# EAGLE design pool-controller-extender (EAGLE 6.5.0)
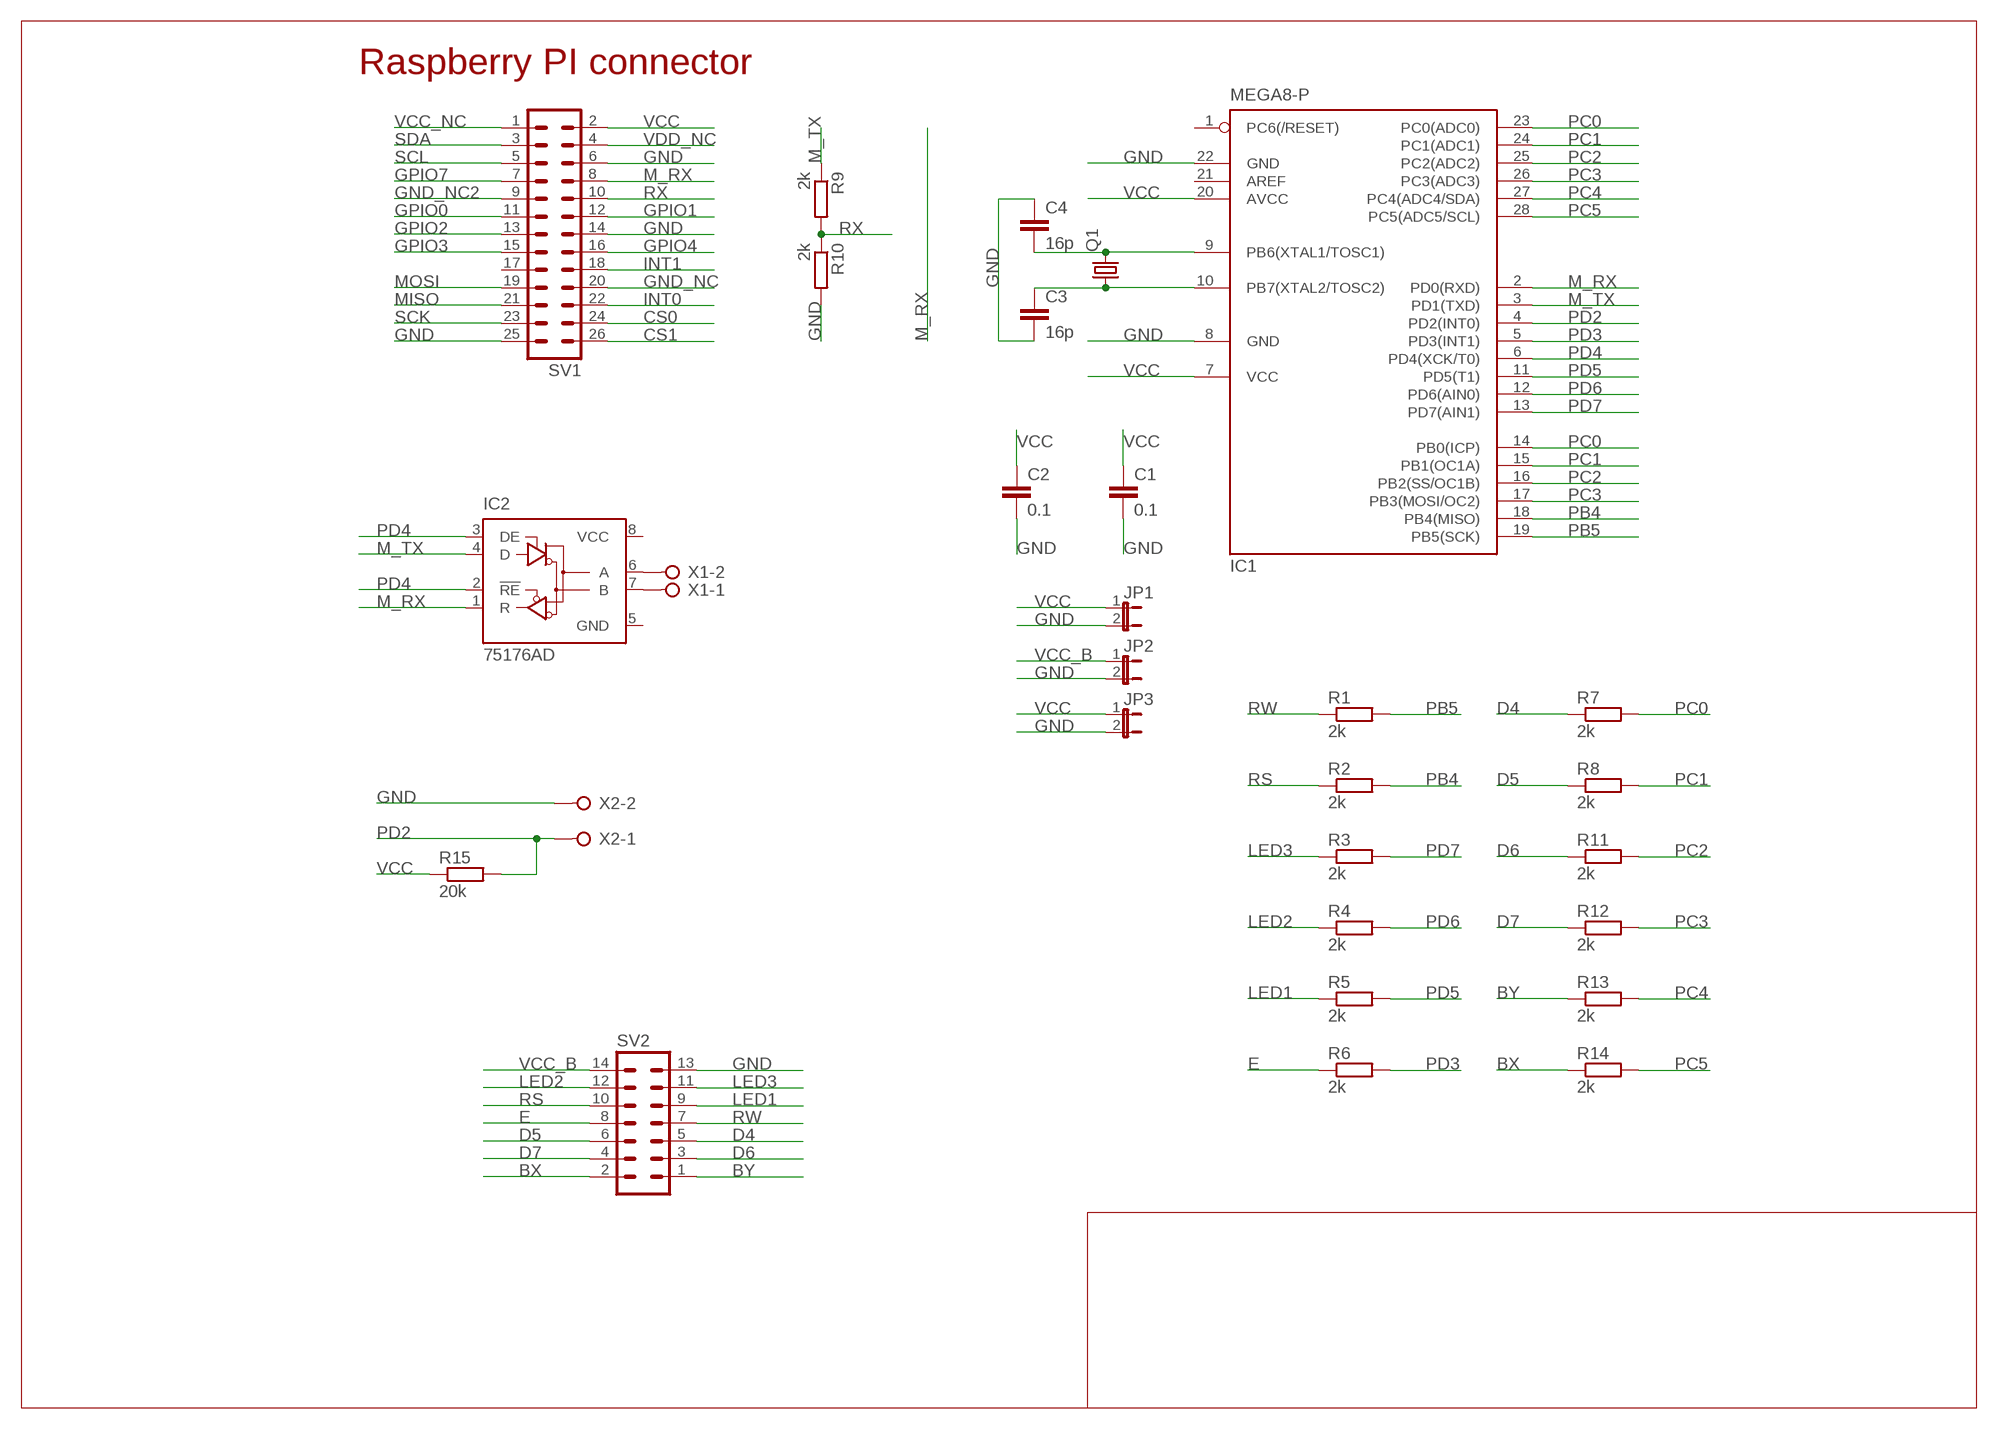
[diagram p0: schematic, sheet 1]

## Parts
C1  0.1  C-EUC0805  [C0805]
C2  0.1  C-EUC0805  [C0805]
C3  16p  C-EUC0805  [C0805]
C4  16p  C-EUC0805  [C0805]
IC1  MEGA8-P  [DIL28-3]
IC2  75176AD  [D_R-PDSO-G8]
JP1  JP1E  [JP1]
JP2  JP1E  [JP1]
JP3  JP1E  [JP1]
Q1  CRYSTALHC49S  [HC49/S]
R1  2k  R-EU_R0805  [R0805]
R2  2k  R-EU_R0805  [R0805]
R3  2k  R-EU_R0805  [R0805]
R4  2k  R-EU_R0805  [R0805]
R5  2k  R-EU_R0805  [R0805]
R6  2k  R-EU_R0805  [R0805]
R7  2k  R-EU_R0805  [R0805]
R8  2k  R-EU_R0805  [R0805]
R9  2k  R-EU_R0805  [R0805]
R10  2k  R-EU_R0805  [R0805]
R11  2k  R-EU_R0805  [R0805]
R12  2k  R-EU_R0805  [R0805]
R13  2k  R-EU_R0805  [R0805]
R14  2k  R-EU_R0805  [R0805]
R15  20k  R-EU_R0805  [R0805]
SV1  MA13-2  [MA13-2]
SV2  MA07-2W  [MA07-2W]
X1  W237-02P  [W237-132]
X2  W237-02P  [W237-132]

## Nets
BX: R14.1 SV2.2
BY: R13.1 SV2.1
CS0: SV1.24
CS1: SV1.26
D4: R7.1 SV2.5
D5: R8.1 SV2.6
D6: R11.1 SV2.3
D7: R12.1 SV2.4
E: R6.1 SV2.8
GND: C1.2 C2.2 C3.2 C4.1 IC1.8(GND) IC1.22(GND) JP1.2 JP2.2 JP3.2 R10.2 SV1.6 SV1.14 SV1.25 SV2.13 X2.2
GND_NC: SV1.20
GND_NC2: SV1.9
GPIO0: SV1.11
GPIO1: SV1.12
GPIO2: SV1.13
GPIO3: SV1.15
GPIO4: SV1.16
GPIO7: SV1.7
INT0: SV1.22
INT1: SV1.18
LED1: R5.1 SV2.9
LED2: R4.1 SV2.12
LED3: R3.1 SV2.11
M_RX: IC1.2(PD0(RXD)) IC2.1(R) SV1.8
M_TX: IC1.3(PD1(TXD)) IC2.4(D) R9.1
MISO: SV1.21
MOSI: SV1.19
N$1: IC2.6(A) X1.2
N$2: IC2.7(B) X1.1
N$4: C3.1 IC1.10(PB7(XTAL2/TOSC2)) Q1.1
N$5: C4.2 IC1.9(PB6(XTAL1/TOSC1)) Q1.2
PB4: IC1.18(PB4(MISO)) R2.2
PB5: IC1.19(PB5(SCK)) R1.2
PC0: IC1.14(PB0(ICP)) IC1.23(PC0(ADC0)) R7.2
PC1: IC1.15(PB1(OC1A)) IC1.24(PC1(ADC1)) R8.2
PC2: IC1.16(PB2(SS/OC1B)) IC1.25(PC2(ADC2)) R11.2
PC3: IC1.17(PB3(MOSI/OC2)) IC1.26(PC3(ADC3)) R12.2
PC4: IC1.27(PC4(ADC4/SDA)) R13.2
PC5: IC1.28(PC5(ADC5/SCL)) R14.2
PD2: IC1.4(PD2(INT0)) R15.2 X2.1
PD3: IC1.5(PD3(INT1)) R6.2
PD4: IC1.6(PD4(XCK/T0)) IC2.2(!RE) IC2.3(DE)
PD5: IC1.11(PD5(T1)) R5.2
PD6: IC1.12(PD6(AIN0)) R4.2
PD7: IC1.13(PD7(AIN1)) R3.2
RS: R2.1 SV2.10
RW: R1.1 SV2.7
RX: R9.2 R10.1 SV1.10
SCK: SV1.23
SCL: SV1.5
SDA: SV1.3
VCC: C1.1 C2.1 IC1.7(VCC) IC1.20(AVCC) JP1.1 JP3.1 R15.1 SV1.2
VCC_B: JP2.1 SV2.14
VCC_NC: SV1.1
VDD_NC: SV1.4
Unconnected: IC1.1(PC6(/RESET)) IC1.21(AREF) SV1.17

## Notes on the sheet
- Raspberry PI connector

## Power pins joined to a net without a drawn wire
GND: IC2.5(GND)
VCC: IC2.8(VCC)

## Library data of the parts
C1-C4 = rcl:C-EU: CAPACITOR, European symbol
IC1 = atmel:MEGA8-P: MICROCONTROLLER 8 Kbytes FLASH, 1 kbytes SRAM, 512 bytes EEPROM, USART, 4-channel 10 bit ADC, 2-channel 8 bit ADC Pin compatible with Atmega48, ATMega88, ATMega168 Source: avr.lbr; OC_FARNELL: unknown; OC_NEWARK: unknown
IC2 = 751xx:75176A: DIFFERENTIAL BUS TRANSCEIVER Source: http://focus.ti.com/lit/ds/symlink/sn75176a.pdf
JP1-JP3 = jumper:JP1E: JUMPER
Q1 = crystal:CRYSTAL: CRYSTAL; OC_FARNELL: 1667008; OC_NEWARK: unknown
R1-R15 = rcl:R-EU_: RESISTOR, European symbol
SV1 = con-lstb:MA13-2: PIN HEADER; OC_FARNELL: unknown; OC_NEWARK: unknown
SV2 = con-lstb:MA07-2W: PIN HEADER; OC_FARNELL: unknown; OC_NEWARK: unknown
X1 X2 = con-wago-508:W237-02P: WAGO SREW CLAMP; OC_FARNELL: unknown; OC_NEWARK: unknown

## Board
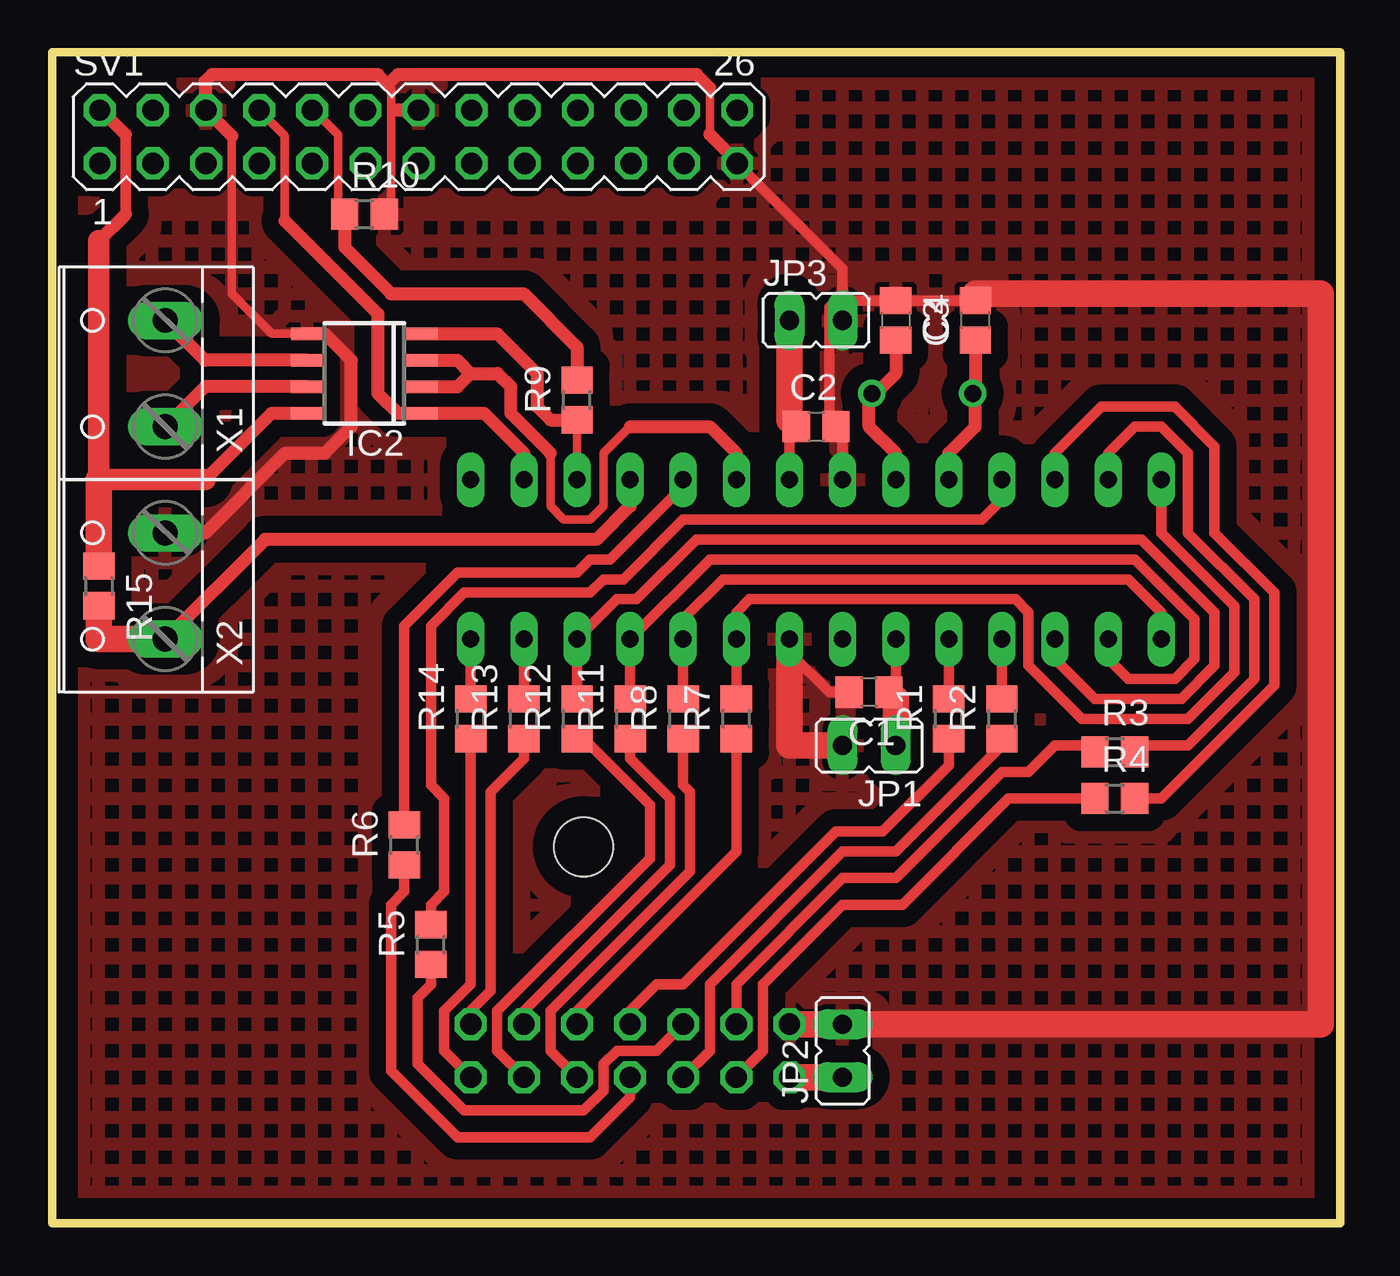
[diagram p1: board, top side]
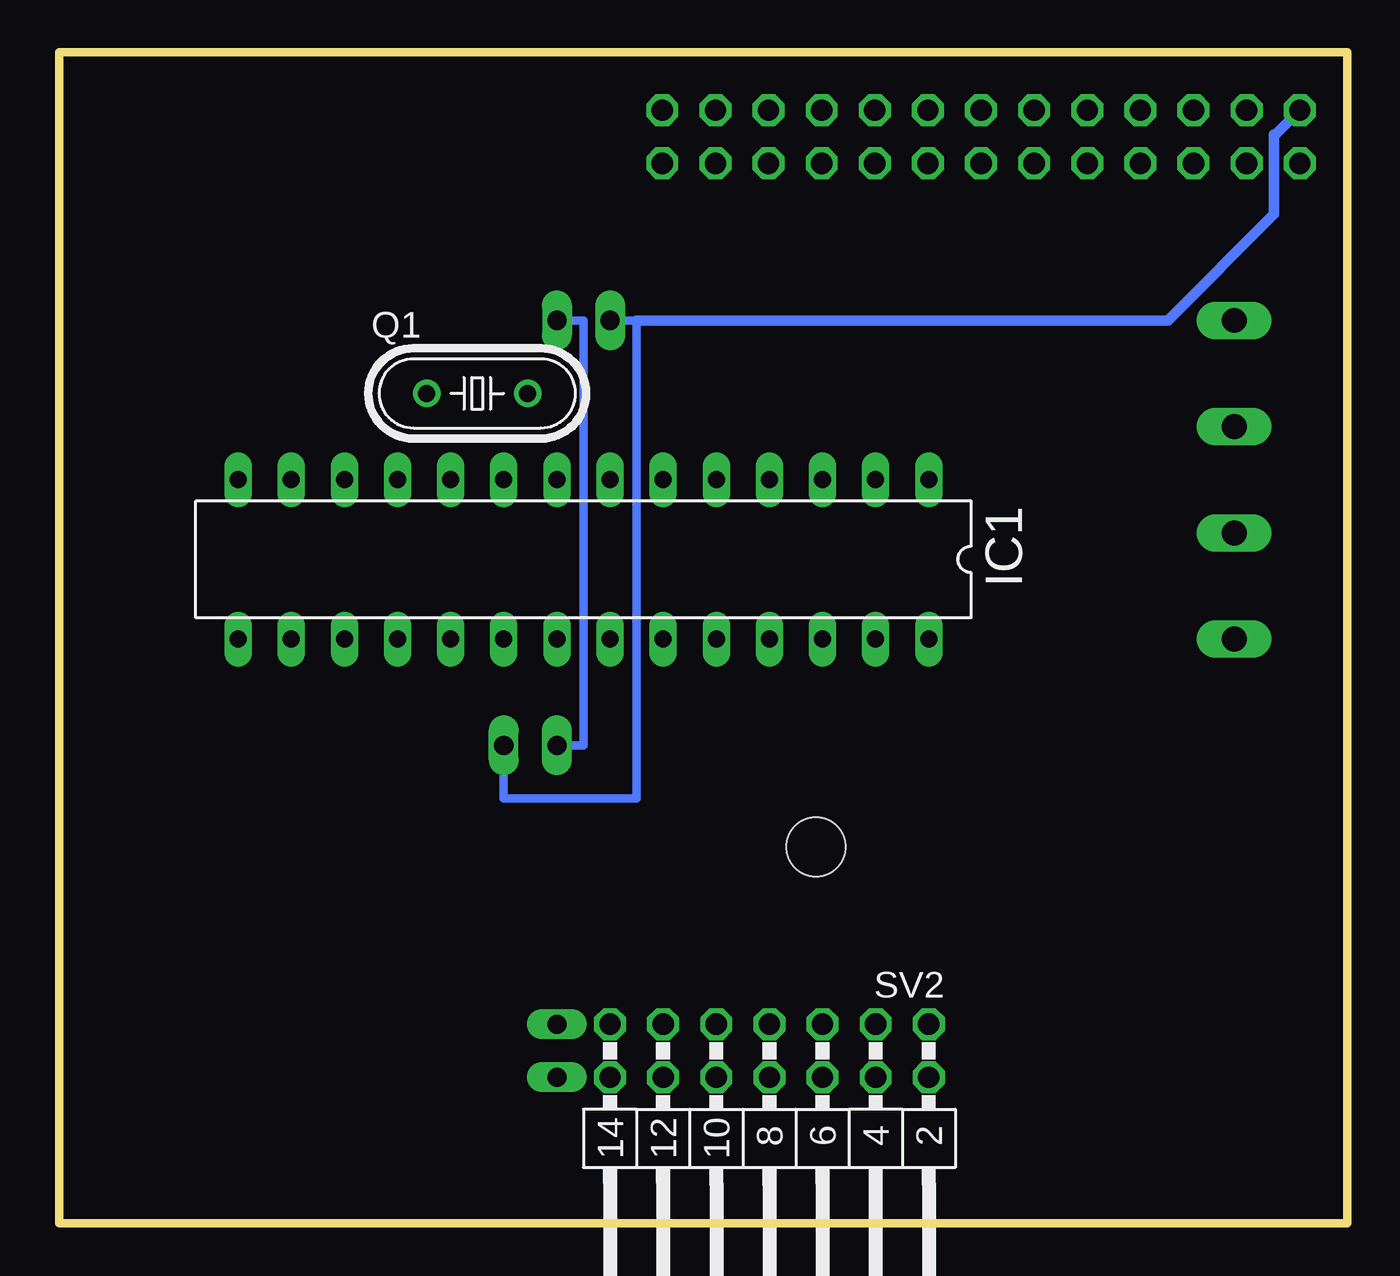
[diagram p2: board, bottom side, seen from below]

Size 61.59 x 56 mm. Coordinates in mm from the lower left corner, seen from the top.
Outline: 0,0 61.59,0 61.59,56 0,56 0,0
Copper layers (1*16): Top 0.035mm / dielectric 1.5mm / Bottom 0.035mm
Design rules "default": minimum track width 10mil, minimum drill 24mil, track to track 8mil, track to pad 8mil, pad to pad 8mil, via to via 8mil, smd to smd 8mil, copper to edge 40mil, drill to drill 8mil, minimum pad ring 10mil, minimum via ring 8mil, stop-mask expansion 4mil, vias tented up to drill 0mil, thermal gap 10mil
Holes 2.8 mm at 25.4,18

### Footprints (pad centres in the part's own frame; a part is rotated, then mirrored left to right if it is on the bottom)
C0805 = smd 1.3 x 1.5: 1 -0.95,0; 2 0.95,0
DIL28-3 = drill 0.813 long: 1 -16.51,-3.81; 2 -13.97,-3.81; 3 -11.43,-3.81; 4 -8.89,-3.81; 5 -6.35,-3.81; 6 -3.81,-3.81; 7 -1.27,-3.81; 8 1.27,-3.81; 9 3.81,-3.81; 10 6.35,-3.81; 11 8.89,-3.81; 12 11.43,-3.81; 13 13.97,-3.81; 14 16.51,-3.81; 15 16.51,3.81; 16 13.97,3.81; 17 11.43,3.81; 18 8.89,3.81; 19 6.35,3.81; 20 3.81,3.81; 21 1.27,3.81; 22 -1.27,3.81; 23 -3.81,3.81; 24 -6.35,3.81; 25 -8.89,3.81; 26 -11.43,3.81; 27 -13.97,3.81; 28 -16.51,3.81
D_R-PDSO-G8 = smd 0.6 x 1.5: 1 -1.905,-2.75; 2 -0.635,-2.75; 3 0.635,-2.75; 4 1.905,-2.75; 5 1.905,2.75; 6 0.635,2.75; 7 -0.635,2.75; 8 -1.905,2.75
JP1 = drill 0.914 long: 1 0,-1.27; 2 0,1.27
HC49/S = drill 0.813: 1 -2.413,0; 2 2.413,0
R0805 = smd 1.3 x 1.5: 1 -0.95,0; 2 0.95,0
MA13-2 = drill 1.016 octagon: 1 -15.24,-1.27; 2 -15.24,1.27; 3 -12.7,-1.27; 4 -12.7,1.27; 5 -10.16,-1.27; 6 -10.16,1.27; 7 -7.62,-1.27; 8 -7.62,1.27; 9 -5.08,-1.27; 10 -5.08,1.27; 11 -2.54,-1.27; 12 -2.54,1.27; 13 0,-1.27; 14 0,1.27; 15 2.54,-1.27; 16 2.54,1.27; 17 5.08,-1.27; 18 5.08,1.27; 19 7.62,-1.27; 20 7.62,1.27; 21 10.16,-1.27; 22 10.16,1.27; 23 12.7,-1.27; 24 12.7,1.27; 25 15.24,-1.27; 26 15.24,1.27
MA07-2W = drill 1.016 octagon: 1 -7.62,-1.27; 2 -7.62,1.27; 3 -5.08,-1.27; 4 -5.08,1.27; 5 -2.54,-1.27; 6 -2.54,1.27; 7 0,-1.27; 8 0,1.27; 9 2.54,-1.27; 10 2.54,1.27; 11 5.08,-1.27; 12 5.08,1.27; 13 7.62,-1.27; 14 7.62,1.27
W237-132 = drill 1.194 long: 1 -2.54,-0.635; 2 2.54,-0.635

### Placement (x,y rotation side)
C1  39.06,25.4 180 top
C2  36.52,38.1 0 top
C3  44.14,43.18 90 top
C4  40.33,43.18 270 top
IC1  36.52,31.75 180 bottom
IC2  14.93,40.64 90 top
JP1  39.06,22.86 90 top
JP2  37.79,8.26 0 top
JP3  36.52,43.18 270 top
Q1  41.6,39.69 0 bottom
R1  42.87,24.13 90 top
R2  45.41,24.13 90 top
R3  50.81,22.54 0 top
R4  50.81,20.32 0 top
R5  18.11,13.34 90 top
R6  16.84,18.1 90 top
R7  32.71,24.13 90 top
R8  30.17,24.13 90 top
R9  25.09,39.37 90 top
R10  14.93,48.26 0 top
R11  27.63,24.13 90 top
R12  25.09,24.13 90 top
R13  22.55,24.13 90 top
R14  20.01,24.13 90 top
R15  2.23,30.48 270 top
SV1  17.51,51.96 0 top
SV2  27.63,8.26 180 bottom
X1  4.77,40.64 90 top
X2  4.77,30.48 90 top

### Tracks (layer width: path | path; a pad name or v marks a point on that pad's centre or on a via)
BX
  Top 0.508: SV2.2 18.74,8.26 18.74,10.16 20.01,11.43 R14.1
BY
  Top 0.508: SV2.1 20.01,10.16 20.96,11.11 20.96,20.64 22.55,22.23 R13.1
D4
  Top 0.508: SV2.5 25.09,10.16 32.71,17.78 R7.1
D5
  Top 0.508: SV2.6 23.82,8.26 23.82,10.16 30.49,16.83 30.49,20.64 30.17,20.95 R8.1
D6
  Top 0.508: R11.1 27.63,22.23 29.54,20.32 29.54,17.14 22.55,10.16 SV2.3
D7
  Top 0.508: SV2.4 21.28,8.26 21.28,10.16 28.58,17.46 28.58,20 25.41,23.18 R12.1
E
  Top 0.508: SV2.8 27.63,6.03 25.73,4.13 19.38,4.13 16.2,7.3 16.2,15.24 16.84,15.88 R6.1
GND
  Top 0.406: 16.2,53.34 16.2,48.58 R10.2 | 16.2,53.34 16.2,54.29 16.04,54.45 | 7.31,53.27 SV1.6 | 16.31,53.23 16.2,53.34 | SV1.25 32.75,50.76 | 31.44,52.07 31.44,54.29 | IC2.5 10.48,42.55 8.58,44.45 8.58,52
  Top 0.508: IC1.8 37.79,37.78 C2.2 37.16,38.41 37.16,43.81 37.47,44.13 37.79,44.13 | C1.2 37.16,25.4 35.25,27.3 IC1.22 | C4.1 C3.2 37.79,44.13 | 37.79,44.13 37.79,45.65 SV1.25
  Top 0.61: 7.31,53.27 7.31,54.61 7.63,54.93 15.56,54.93 16.04,54.45 16.52,54.93 30.8,54.93 31.44,54.29 | SV1.14 16.31,53.23 | 32.75,50.76 31.44,52.07 | 8.58,52 SV1.6 | X2.2 7.31,33.02 11.12,36.83 13.03,36.83 14.29,38.1 14.29,41.27 13.03,42.55 IC2.5
  Top 1.27: SV1.25 32.86,50.8 | JP1.2 35.25,22.86 IC1.22 | SV2.13 JP2.2 60.65,9.53 60.65,44.45 44.14,44.45 C3.2
  Bottom 0.406: JP3.2 36.52,43.18 36.52,22.86 JP1.2
  pour Top (isolate 0.813, hatched): 0.01,0 61.6,0 61.6,55.88 0.01,55.88
LED1
  Top 0.508: SV2.9 28.9,8.26 27,8.26 26.36,7.62 26.36,6.35 25.41,5.4 19.69,5.4 17.47,7.62 17.47,10.79 18.11,11.43 R5.1
LED2
  Top 0.508: R4.1 45.73,20.32 40.65,15.24 37.79,15.24 33.98,11.43 33.98,8.26 SV2.12
LED3
  Top 0.508: SV2.11 32.71,11.43 37.79,16.51 40.33,16.51 45.41,21.59 46.68,21.59 47.95,22.86 49.54,22.86 R3.1
M_RX
  Top 0.406: IC1.2 22.55,36.83 | 11.12,47.94 11.12,52 SV1.8
  Top 0.61: 22.55,36.83 20.64,38.73 IC2.1 16.52,38.73 15.56,39.69 15.56,43.5 11.12,47.94
M_TX
  Top 0.406: IC1.3 R9.1
  Top 0.61: IC2.4 21.28,42.55 23.19,40.64 23.19,39.05 23.82,38.42 R9.1
N$1
  Top 0.61: IC2.6 7.31,41.27 X1.2
N$2
  Top 0.61: IC2.7 7.31,40.01 X1.1
N$4
  Top 0.508: 44.14,39.56 Q1.1 44.14,39.81
  Top 0.61: IC1.10 42.87,36.83 44.14,38.1 44.14,39.56 | C3.1 44.14,39.81
N$5
  Top 0.508: 39.06,39.56 Q1.2 39.06,39.81
  Top 0.61: IC1.9 40.33,36.83 39.06,38.1 39.06,39.56 | C4.2 40.33,40.64 39.38,39.69 Q1.2
PB4
  Top 0.508: IC1.18 R2.2
PB5
  Top 0.508: IC1.19 R1.2
PC0
  Top 0.508: IC1.14 53.03,33.02 56.52,29.53 56.52,26.35 54.3,24.13 49.22,24.13 46.68,26.67 46.68,29.21 46.04,29.84 33.34,29.84 32.71,29.21 IC1.23 R7.2
PC1
  Top 0.508: IC1.15 53.03,29.21 51.44,30.8 32.07,30.8 30.17,28.89 IC1.24 R8.2
PC2
  Top 0.508: IC1.16 50.49,26.99 51.44,26.04 53.66,26.04 54.62,26.99 54.62,28.89 51.76,31.75 31.44,31.75 IC1.25 R11.2
PC3
  Top 0.508: IC1.17 47.95,26.99 49.85,25.08 53.98,25.08 55.57,26.67 55.57,29.21 52.08,32.7 30.8,32.7 27.95,29.84 27,29.84 IC1.26 R12.2
PC4
  Top 0.508: R13.2 IC1.27
PC5
  Top 0.508: IC1.28 R14.2
PD2
  Top 0.61: IC1.4 27.63,34.29 26.04,32.7 10.17,32.7 X2.1
  Top 1.27: X2.1 2.23,27.94 R15.2
PD3
  Top 0.508: R6.2 16.84,28.57 19.38,31.11 25.09,31.11 25.73,31.75 26.68,31.75 30.17,35.24 IC1.5
PD4
  Top 0.406: 23.82,36.83 23.82,34.29 24.46,33.66 25.73,33.66 26.36,34.29 26.36,36.83 27.63,38.1
  Top 0.61: IC2.3 19.38,41.27 20.01,40.64 | IC2.2 19.38,40.01 20.01,40.64 | 20.01,40.64 21.28,40.64 21.92,40.01 21.92,38.73 23.82,36.83 | 27.63,38.1 31.44,38.1 32.71,36.83 IC1.6
PD5
  Top 0.508: R5.2 18.11,15.24 18.74,15.88 18.74,20.32 18.11,20.95 18.11,28.57 19.69,30.16 25.73,30.16 26.36,30.8 27.31,30.8 30.17,33.66 44.46,33.66 45.41,34.61 IC1.11
PD6
  Top 0.508: IC1.12 47.95,36.83 50.17,39.05 53.66,39.05 55.57,37.15 55.57,33.02 58.43,30.16 58.43,25.72 53.03,20.32 R4.2
PD7
  Top 0.508: IC1.13 50.49,36.83 51.76,38.1 53.03,38.1 54.3,36.83 54.3,33.02 57.47,29.84 57.47,26.04 54.3,22.86 52.07,22.86 R3.2
RS
  Top 0.508: SV2.10 31.44,8.26 31.44,11.43 37.79,17.78 40.33,17.78 45.41,22.86 R2.1
RW
  Top 0.508: R1.1 42.87,21.91 39.7,18.73 37.47,18.73 30.17,11.43 28.9,11.43 27.63,10.16 SV2.7
RX
  Top 0.406: SV1.10 12.5,53.23 13.66,52.07 13.66,48.58 R10.1
  Top 0.61: R10.1 13.98,46.67 16.2,44.45 22.55,44.45 25.09,41.91 R9.2
VCC
  Top 0.508: IC1.7 35.25,37.78 C2.1 | IC1.20 40.33,25.72 C1.1 | 3.5,52.07 3.5,48.26
  Top 0.61: SV1.2 2.34,53.23 3.5,52.07 | IC2.8 10.48,38.73 7.31,35.56 | 3.5,48.26 2.23,46.99
  Top 1.016: 2.23,46.99 2.23,35.56 7.31,35.56
  Top 1.27: C2.1 35.25,38.42 JP3.1 | C1.1 40.33,25.08 JP1.1 | R15.1 2.23,35.56
  Bottom 0.406: JP1.1 40.33,20.32 33.98,20.32 33.98,43.18 JP3.1
  Bottom 0.508: 33.98,43.18 8.58,43.18 3.5,48.26 3.5,52.07 3.43,52.07 SV1.2
VCC_B
  Top 1.27: SV2.14 JP2.1